# EAGLE schematic atmega48A_dip_jumpers (EAGLE 6.4)
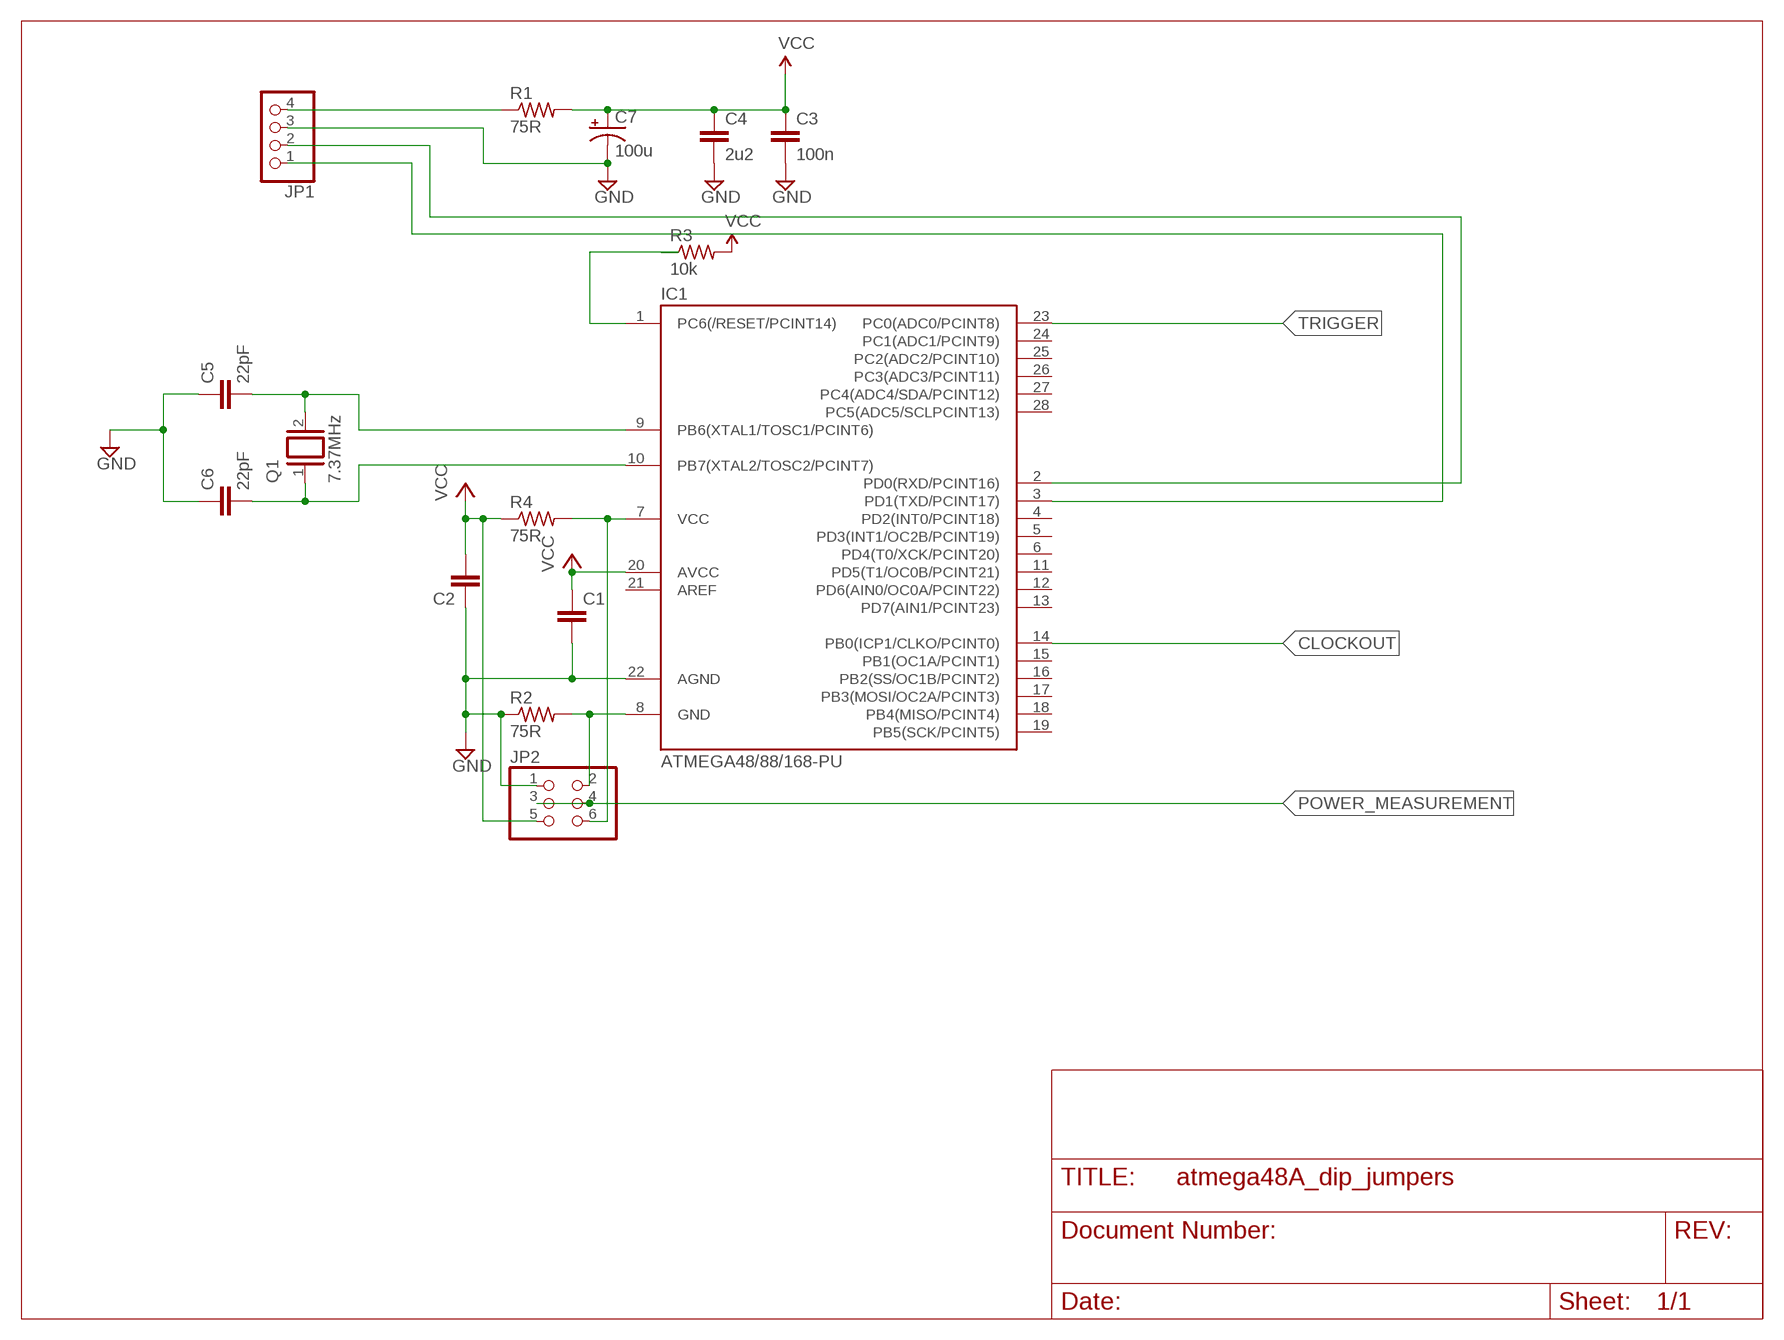
[diagram p0: schematic, sheet 1]

## Parts
C1  C-EUC0805  [C0805]
C2  C-EUC0805  [C0805]
C3  100n  C-EUC0805  [C0805]
C4  2u2  C-EUC0805  [C0805]
C5  22pF  C-EUC0805  [C0805]
C6  22pF  C-EUC0805  [C0805]
C7  100u  CPOL-US140CLH-0810  [140CLH-0810]
IC1  ATMEGA48/88/168-PU  [DIL28-3]
JP1  PINHD-1X4/90  [1X04/90]
JP2  PINHD-2X3  [2X03]
Q1  7.37MHz  XTAL  [Q]
R1  75R  R-US_M0805  [M0805]
R2  75R  R-US_R0805  [R0805]
R3  10k  R-US_M0805  [M0805]
R4  75R  R-US_R0805  [R0805]

## Nets
GND: C1.2 C2.1 C3.2 C4.2 C5.1 C6.1 C7.- IC1.22(AGND) JP1.3 JP2.1 R2.1
N$1: IC1.2(PD0(RXD/PCINT16)) JP1.2
N$2: C5.2 IC1.9(PB6(XTAL1/TOSC1/PCINT6)) Q1.2
N$3: IC1.3(PD1(TXD/PCINT17)) JP1.1
N$4: IC1.7(VCC) JP2.6 R4.2
N$5: IC1.1(PC6(/RESET/PCINT14))
N$6: JP1.4 R1.1
N$7: IC1.8(GND) JP2.2 R2.2
N$8: C6.2 IC1.10(PB7(XTAL2/TOSC2/PCINT7)) Q1.1
POWER_MEASUREMENT: JP2.3 JP2.4
TRIGGER: IC1.23(PC0(ADC0/PCINT8))
VCC: C1.1 C2.2 C3.1 C4.1 C7.+ IC1.20(AVCC) JP2.5 R1.2 R3.2 R4.1
Unconnected: IC1.4(PD2(INT0/PCINT18)) IC1.5(PD3(INT1/OC2B/PCINT19)) IC1.6(PD4(T0/XCK/PCINT20)) IC1.11(PD5(T1/OC0B/PCINT21)) IC1.12(PD6(AIN0/OC0A/PCINT22)) IC1.13(PD7(AIN1/PCINT23)) IC1.14(PB0(ICP1/CLKO/PCINT0)) IC1.15(PB1(OC1A/PCINT1)) IC1.16(PB2(SS/OC1B/PCINT2)) IC1.17(PB3(MOSI/OC2A/PCINT3)) IC1.18(PB4(MISO/PCINT4)) IC1.19(PB5(SCK/PCINT5)) IC1.21(AREF) IC1.24(PC1(ADC1/PCINT9)) IC1.25(PC2(ADC2/PCINT10)) IC1.26(PC3(ADC3/PCINT11)) IC1.27(PC4(ADC4/SDA/PCINT12)) IC1.28(PC5(ADC5/SCLPCINT13)) R3.1

## Library data of the parts
C1-C6 = rcl:C-EU: CAPACITOR, European symbol
C7 = rcl:CPOL-US: POLARIZED CAPACITOR, American symbol
IC1 = atmega8:ATMEGA48/88/168-PU
JP1 = pinhead:PINHD-1X4: PIN HEADER
JP2 = pinhead:PINHD-2X3: PIN HEADER
Q1 = special:XTAL: CRYSTAL
R1 R3 = adafruit:R-US_: RESISTOR, American symbol
R2 R4 = resistor:R-US_: RESISTOR, American symbol